# Altium project FMC_130MSPS.PrjPCB (part 2 of 2)

## Sheet ADC.SchDoc
size A3
Used 4 times, as channels U_ADC1, U_ADC2, U_ADC3, U_ADC4. Parts and nets are listed once, with the designators drawn on the sheet.
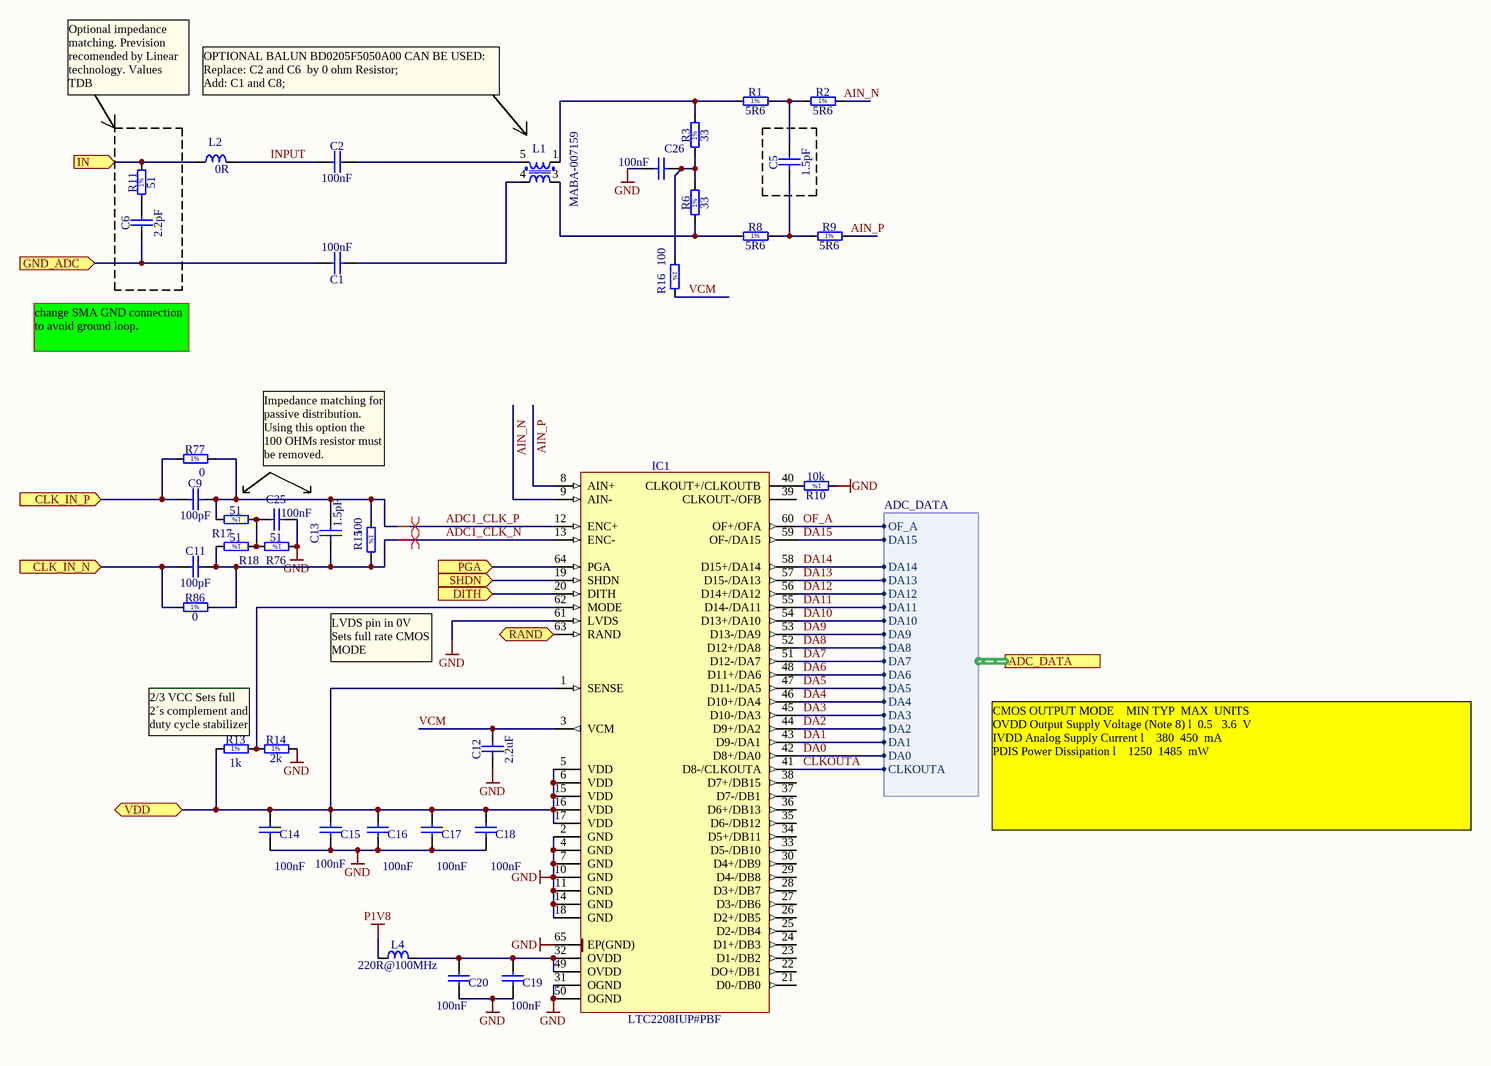
[diagram p3: ADC.SchDoc]

### Parts
C1  100nF  [CAPC0603X33N]
C2  100nF  [CAPC0603X33N]
C5  1.5pF  [CAPC1005X55N]
C6  2.2pF  [CAPC1005X55N]
C9  100pF  [CAPC1005X55N]
C11  100pF  [CAPC1005X55N]
C12  2.2uF  [CAPC1608X87N]
C13  1.5pF  [CAPC1005X55N]
C14  100nF  [CAPC0603X33N]
C15  100nF  [CAPC0603X33N]
C16  100nF  [CAPC0603X33N]
C17  100nF  [CAPC0603X33N]
C18  100nF  [CAPC0603X33N]
C19  100nF  [CAPC0603X33N]
C20  100nF  [CAPC0603X33N]
C25  100nF  [CAPC0603X33N]
C26  100nF  [CAPC0603X33N]
IC1  LTC2208IUP#PBF  [QFN50P900X900X80-65N-S725]
L1  MABA-007159  [XFMR_MA-COM_SM-22 (H260)]
L2  0R  [INDC1005X55N]
L4  220R@100MHz  [INDC2012X105N]
R1  5R6  [RESC1005X40N]
R2  5R6  [RESC1005X40N]
R3  33  [RESC1005X40N]
R6  33  [RESC1005X40N]
R8  5R6  [RESC1005X40N]
R9  5R6  [RESC1005X40N]
R10  10k  [RESC1005X40N]
R11  51  [RESC1005X40N]
R13  1k  [RESC1005X40N]
R14  2k  [RESC1005X40N]
R15  100  [RESC1005X40N]
R16  100  [RESC1005X40N]
R17  51  [RESC1005X40N]
R18  51  [RESC1005X40N]
R76  51  [RESC1005X40N]
R77  0  [RESC1005X40N]
R86  0  [RESC1005X40N]

### Ports
ADC_DATA (harness ADC_DATA), CLK_IN_N (in), CLK_IN_P (in), DITH (in), GND_ADC (in), IN (in), PGA (in), RAND (in), SHDN (in), VDD

### Harnesses
ADC_DATA: CLKOUTA, DA0, DA1, DA2, DA3, DA4, DA5, DA6, DA7, DA8, DA9, DA10, DA11, DA12, DA13, DA14, DA15, OF_A

### Nets
GND: C12.1 C14.1 C15.1 C16.1 C17.1 C18.1 C19.1 C20.1 C25.1 C26.2 IC1.2(GND) IC1.4(GND) IC1.7(GND) IC1.10(GND) IC1.11(GND) IC1.14(GND) IC1.18(GND) IC1.31(OGND) IC1.50(OGND) IC1.61(LVDS) IC1.65(EP(GND)) R10.1 R14.2 R76.1
P1V8: L4.1
ADC1_CLK_N: C11.2 C13.1 IC1.13(ENC-) R15.2 R18.2 R86.2
ADC1_CLK_P: C9.2 C13.2 IC1.12(ENC+) R15.1 R17.2 R77.2
AIN_N: IC1.9(AIN-) R2.2
AIN_P: IC1.8(AIN+) R9.2
CLK_IN_N: C11.1 R86.1 ; port CLK_IN_N
CLK_IN_P: C9.1 R77.1 ; port CLK_IN_P
CLKOUTA: IC1.41(D8-/CLKOUTA) ; port ADC_DATA.CLKOUTA
DA0: IC1.42(D8+/DA0) ; port ADC_DATA.DA0
DA1: IC1.43(D9-/DA1) ; port ADC_DATA.DA1
DA2: IC1.44(D9+/DA2) ; port ADC_DATA.DA2
DA3: IC1.45(D10-/DA3) ; port ADC_DATA.DA3
DA4: IC1.46(D10+/DA4) ; port ADC_DATA.DA4
DA5: IC1.47(D11-/DA5) ; port ADC_DATA.DA5
DA6: IC1.48(D11+/DA6) ; port ADC_DATA.DA6
DA7: IC1.51(D12-/DA7) ; port ADC_DATA.DA7
DA8: IC1.52(D12+/DA8) ; port ADC_DATA.DA8
DA9: IC1.53(D13-/DA9) ; port ADC_DATA.DA9
DA10: IC1.54(D13+/DA10) ; port ADC_DATA.DA10
DA11: IC1.55(D14-/DA11) ; port ADC_DATA.DA11
DA12: IC1.56(D14+/DA12) ; port ADC_DATA.DA12
DA13: IC1.57(D15-/DA13) ; port ADC_DATA.DA13
DA14: IC1.58(D15+/DA14) ; port ADC_DATA.DA14
DA15: IC1.59(OF-/DA15) ; port ADC_DATA.DA15
DITH: IC1.20(DITH) ; port DITH
GND_ADC: C1.2 C6.1 ; port GND_ADC
IN: L2.1 R11.2 ; port IN
INPUT: C2.1 L2.2
OF_A: IC1.60(OF+/OFA) ; port ADC_DATA.OF_A
PGA: IC1.64(PGA) ; port PGA
RAND: IC1.63(RAND) ; port RAND
SHDN: IC1.19(SHDN) ; port SHDN
VCM: C12.2 IC1.3(VCM) R16.2
VDD: C14.2 C15.2 C16.2 C17.2 C18.2 IC1.1(SENSE) IC1.5(VDD) IC1.6(VDD) IC1.15(VDD) IC1.16(VDD) IC1.17(VDD) R13.1 ; port VDD
NetC1_1: C1.1 L1.4
NetC2_2: C2.2 L1.5
NetC5_1: C5.1 R8.2 R9.1
NetC5_2: C5.2 R1.2 R2.1
NetC6_2: C6.2 R11.1
NetC19_2: C19.2 C20.2 IC1.32(OVDD) IC1.49(OVDD) L4.2
NetC25_2: C25.2 R17.1 R18.1 R76.2
NetC26_1: C26.1 R3.1 R6.2 R16.1
NetIC1_40: IC1.40(CLKOUT+/CLKOUTB) R10.2
NetIC1_62: IC1.62(MODE) R13.2 R14.1
NetL1_1: L1.1 R1.1 R3.2
NetL1_3: L1.3 R6.1 R8.1

Not connected (* = marked no-connect by the designer): IC1 21(D0-/DB0) 22(DO+/DB1) 23(D1-/DB2) 24(D1+/DB3) 25(D2-/DB4) 26(D2+/DB5) 27(D3-/DB6) 28(D3+/DB7) 29(D4-/DB8) 30(D4+/DB9) 33(D5-/DB10) 34(D5+/DB11) 35(D6-/DB12) 36(D6+/DB13) 37(D7-/DB1) 38(D7+/DB15) 39(CLKOUT-/OFB)

### Channels
U_ADC1: designators end in A; ports CLK_IN_N=ADC1_CLK_N CLK_IN_P=ADC1_CLK_P DITH=DITH_ON_OFF GND_ADC=NetC1A_2 IN=NetJ6_1 PGA=PGA_1_0 RAND=RAND_ON_OFF SHDN=SHDN_ON_OFF VDD=P3V3_ADC1
U_ADC2: designators end in B; ports CLK_IN_N=ADC2_CLK_N CLK_IN_P=ADC2_CLK_P DITH=DITH_ON_OFF GND_ADC=NetC1B_2 IN=NetJ8_1 PGA=PGA_1_0 RAND=RAND_ON_OFF SHDN=SHDN_ON_OFF VDD=P3V3_ADC2
U_ADC3: designators end in C; ports CLK_IN_N=ADC3_CLK_N CLK_IN_P=ADC3_CLK_P DITH=DITH_ON_OFF GND_ADC=NetC1C_2 IN=NetJ7_1 PGA=PGA_1_0 RAND=RAND_ON_OFF SHDN=SHDN_ON_OFF VDD=P3V3_ADC3
U_ADC4: designators end in D; ports CLK_IN_N=ADC4_CLK_N CLK_IN_P=ADC4_CLK_P DITH=DITH_ON_OFF GND_ADC=NetC1D_2 IN=NetJ5_1 PGA=PGA_1_0 RAND=RAND_ON_OFF SHDN=SHDN_ON_OFF VDD=P3V3_ADC4

### Layout directives
differential pair: ADC1_CLK_N_U_ADC1, ADC1_CLK_P_U_ADC1

### Notes on the sheet
- Optional impedance matching. Prevision recomended by Linear technology. Values TDB
- OPTIONAL BALUN BD0205F5050A00 CAN BE USED:
  Replace: C2 and C6  by 0 ohm Resistor;
  Add: C1 and C8;
- change SMA GND connection to avoid ground loop.
- Impedance matching for passive distribution. Using this option the 100 OHMs resistor must be removed.
- LVDS pin in 0V Sets full rate CMOS MODE
- 2/3 VCC Sets full 2´s complement and duty cycle stabilizer
- CMOS OUTPUT MODE 	 	MIN	TYP 	MAX 	UNITS
  OVDD Output Supply Voltage (Note 8) l 	0.5 		3.6 	V
  IVDD Analog Supply Current l 			380 	450	 mA
  PDIS Power Dissipation l 			1250 	1485 	mW
- (in symbol R0402_0R_JUMPER) 1%
- (in symbol R0402_1K_1%_0.0625W_100PPM) 1%
- (in symbol R0402_2K_1%_0.0625W_100PPM) 1%
- (in symbol R0402_5R6_1%_0.0625W_200PPM) 1%
- (in symbol R0402_10K_1%_0.0625W_100PPM) 1%
- (in symbol R0402_33R_1%_0.0625W_100PPM) 1%
- (in symbol R0402_51R_1%_0.0625W_100PPM) 1%
- (in symbol R0402_100R_1%_0.0625W_100PPM) 1%

### Library data of the parts
C1 C2 C14-C20 C25 C26 = CC0201_100NF_6.3V_10%_X5R: Non-polarised capacitor; Part Description: SMD Multilayer Chip Ceramic Capacitor; Manufacturer: GENERIC; Manufacturer1 Part Number: 02016D104KAT2A; Voltage: 6.3V; TC: X5R; Tolerance: ±10%; Table: Capacitors SMD; Part Number: CC0201_100NF_6.3V_10%_X5R; Component Kind: Standard; Component Type: Standard; Pin Count: 2; Value: 100nF; Status: Not Recommended; Manufacturer Part Number: CC0201_100NF_6.3V_10%_X5R; Case: 0201; Mounted: Yes; Socket: No; SMD: Yes; Manufacturer1 Example: AVX; Manufacturer1 ComponentHeight: 0.33mm; HelpURL: \\cern.ch\dfs\Applications\Altium\Datasheets\CC0201_X5R_AVX.pdf; Author: CERN DEM JLC; CreateDate: 2007-12-03; LatestRevisionDate: 2007-12-03
C5 C13 = CC0402_1.5PF_50V_0.25PF_NP0: Non-polarised capacitor; Part Description: SMD Multilayer Chip Ceramic Capacitor; Manufacturer: GENERIC; Manufacturer1 Part Number: 223886915158; Voltage: 50V; TC: NP0; Tolerance: ±0.25pF; Table: Capacitors SMD; Part Number: CC0402_1.5PF_50V_0.25PF_NP0; Component Kind: Standard; Component Type: Standard; Pin Count: 2; Value: 1.5pF; Status: Not Recommended; Manufacturer Part Number: CC0402_1.5PF_50V_0.25PF_NP0; Case: 0402; Mounted: Yes; Socket: No; SMD: Yes; Manufacturer1 Example: PHYCOMP; Manufacturer1 ComponentHeight: 0.55mm; HelpURL: \\cern.ch\dfs\Applications\Altium\Datasheets\CC0402_NP0_PHYCOMP.pdf; Author: CERN DEM JLC; CreateDate: 3/12/2007; LatestRevisionDate: 3/12/2007
C6 = CC0402_2.2PF_50V_0.25PF_NP0: Non-polarised capacitor; Part Description: SMD Multilayer Chip Ceramic Capacitor; Manufacturer: GENERIC; Manufacturer1 Part Number: 223886915228; Voltage: 50V; TC: NP0; Tolerance: ±0.25pF; Table: Capacitors SMD; Part Number: CC0402_2.2PF_50V_0.25PF_NP0; Component Kind: Standard; Component Type: Standard; Pin Count: 2; Value: 2.2pF; Status: Not Recommended; Manufacturer Part Number: CC0402_2.2PF_50V_0.25PF_NP0; Case: 0402; Mounted: Yes; Socket: No; SMD: Yes; Manufacturer1 Example: PHYCOMP; Manufacturer1 ComponentHeight: 0.55mm; HelpURL: \\cern.ch\dfs\Applications\Altium\Datasheets\CC0402_NP0_PHYCOMP.pdf; Author: CERN DEM JLC; CreateDate: 2007-12-03; LatestRevisionDate: 2007-12-03
C9 C11 = CC0402_100PF_50V_5%_NP0: Non-polarised capacitor; Part Description: SMD Multilayer Chip Ceramic Capacitor; Manufacturer: GENERIC; Manufacturer1 Part Number: 223886915101; Voltage: 50V; TC: NP0; Tolerance: ±5%; Table: Capacitors SMD; Part Number: CC0402_100PF_50V_5%_NP0; Component Kind: Standard; Component Type: Standard; Pin Count: 2; Value: 100pF; Status: Not Recommended; Manufacturer Part Number: CC0402_100PF_50V_5%_NP0; Case: 0402; Mounted: Yes; Socket: No; SMD: Yes; Manufacturer1 Example: PHYCOMP; Manufacturer1 ComponentHeight: 0.55mm; HelpURL: \\cern.ch\dfs\Applications\Altium\Datasheets\CC0402_NP0_PHYCOMP.pdf; Author: CERN DEM JLC; CreateDate: 3/12/2007; LatestRevisionDate: 3/12/2007
C12 = CC0603_2.2UF_16V_10%_X5R: Non-polarised capacitor; Part Description: SMD Multilayer Chip Ceramic Capacitor; Manufacturer: GENERIC; Manufacturer1 Part Number: CC0603KRX5R7BB225; Voltage: 16V; TC: X5R; Tolerance: ±10%; Table: Capacitors SMD; Part Number: CC0603_2.2UF_16V_10%_X5R; Component Kind: Standard; Component Type: Standard; Pin Count: 2; Value: 2.2uF; Status: Preferred; Manufacturer Part Number: CC0603_2.2UF_16V_10%_X5R; Case: 0603; Mounted: Yes; Socket: No; SMD: Yes; Manufacturer1 Example: YAGEO; Manufacturer1 ComponentHeight: 0.9mm; HelpURL: \\cern.ch\dfs\Applications\Altium\Datasheets\CC0805_X5R_PHYCOMP_HC.pdf; Author: CERN DEM JLC; CreateDate: 28/4/2011; LatestRevisionDate: 28/4/2011
IC1 = LTC2LTC2208IUP#PBF: 16-Bit, 130Msps ADC; Manufacturer: LINEAR TECHNOLOGY; Table: Analog & Interface; Part Number: LTC2LTC2208IUP#PBF; Component Kind: Standard; Component Type: Standard; Device: LTC2208IUP#PBF; PackageDescription: QFN, 0.50mm Pitch, Square; 64 Pin, 9.00mm L X 9.00mm W X 0.80mm H body (7.25mm X 7.25mm Thermal Tab), IPC Medium Density; Part Description: 16-Bit, 130Msps ADC; Manufacturer Part Number: LTC2208IUP#PBF; Pin Count: 65; Case: QFN64; Mounted: Yes; Socket: No; SMD: Yes; ComponentHeight: 0.8mm; Author: CERN DEM JLC; HelpURL: \\cern.ch\dfs\Applications\Altium\Datasheets\LTC2208IUP#PBF.pdf; CreateDate: 18/9/2012; LatestRevisionDate: 18/9/2012
L1 = XFMR_MA-COM_MABA-007159-000000_modified: MA-COM E-Serie RF 1:1 Transmission Line Ttransformer 4.5-3000MHz; name: MABA-007159
L2 = IND0402_MURATA_BLM15HB221SN1: Inductor; Part Description: SMD EMIFIL Suppression Chip Ferrite Bead; Manufacturer: MURATA; Value: 220R@100MHz; Power: 250mA; Resistance: 1R; Tolerance: ±25%; Table: Inductors SMD; Part Number: IND0402_MURATA_BLM15HB221SN1; Component Kind: Standard; Component Type: Standard; Pin Count: 2; Status: None; Manufacturer Part Number: BLM15HB221SN1; Case: 0402; Mounted: Yes; Socket: No; SMD: Yes; ComponentHeight: 0.55mm; HelpURL: \\cern.ch\dfs\Applications\Altium\Datasheets\IND0402_MURATA_BLM15H.pdf; Author: CERN DEM JLC; CreateDate: 23/6/2009; LatestRevisionDate: 23/6/2009
L4 = IND0805_MURATA_BLM21PG221SN1D: Inductor; Part Description: SMD EMIFIL Suppression Chip Ferrite Bead; Manufacturer: MURATA; Power: 2A; Resistance: 0.05R; Tolerance: ±25%; Table: Inductors SMD; Part Number: IND0805_MURATA_BLM21PG221SN1D; Component Kind: Standard; Component Type: Standard; Pin Count: 2; Value: 220R@100MHz; Status: None; Manufacturer Part Number: BLM21PG221SN1D; Case: 0805; Mounted: Yes; Socket: No; SMD: Yes; ComponentHeight: 1.05mm; HelpURL: \\cern.ch\dfs\Applications\Altium\Datasheets\IND0402_MURATA_BLM21P.pdf; Author: CERN DEM JLC; CreateDate: 25/1/2010; LatestRevisionDate: 25/1/2010
R1 R2 R8 R9 = R0402_5R6_1%_0.0625W_200PPM: Resistor - 1%; Part Description: General Purpose Thick Film Chip Resistor; Manufacturer: GENERIC; Manufacturer1 Part Number: 232270675608L; TC: ±200ppm/°C; Table: Resistors SMD; Part Number: R0402_5R6_1%_0.0625W_200PPM; Component Kind: Standard; Component Type: Standard; Pin Count: 2; Value: 5R6; Status: Not recommended; Power: 0.0625W; Tolerance: ±1%; Manufacturer Part Number: R0402_5R6_1%_0.0625W_200PPM; Case: 0402; Mounted: Yes; Socket: No; SMD: Yes; Manufacturer1 Example: YAGEO PHYCOMP; Manufacturer1 ComponentHeight: 0.4mm; HelpURL: \\cern.ch\dfs\Applications\Altium\Datasheets\R0402_Phycomp_RC0402.pdf; Author: CERN DEM JLC; CreateDate: 24/6/2009; LatestRevisionDate: 17/10/2012
R3 R6 = R0402_33R_1%_0.0625W_100PPM: Resistor - 1%; Part Description: General Purpose Thick Film Chip Resistor; Manufacturer: GENERIC; Manufacturer1 Part Number: 232270673309L; TC: ±100ppm/°C; Table: Resistors SMD; Part Number: R0402_33R_1%_0.0625W_100PPM; Component Kind: Standard; Component Type: Standard; Pin Count: 2; Value: 33; Status: Not recommended; Power: 0.0625W; Tolerance: ±1%; Manufacturer Part Number: R0402_33R_1%_0.0625W_100PPM; Case: 0402; Mounted: Yes; Socket: No; SMD: Yes; Manufacturer1 Example: YAGEO PHYCOMP; Manufacturer1 ComponentHeight: 0.4mm; HelpURL: \\cern.ch\dfs\Applications\Altium\Datasheets\R0402_Phycomp_RC0402.pdf; Author: CERN DEM JLC; CreateDate: 03/12/2007; LatestRevisionDate: 17/10/2012
R10 = R0402_10K_1%_0.0625W_100PPM: Resistor - 1%; Part Description: General Purpose Thick Film Chip Resistor; Manufacturer: GENERIC; Manufacturer1 Part Number: 232270671003L; TC: ±100ppm/°C; Table: Resistors SMD; Part Number: R0402_10K_1%_0.0625W_100PPM; Component Kind: Standard; Component Type: Standard; Pin Count: 2; Value: 10k; Status: Not recommended; Power: 0.0625W; Tolerance: ±1%; Manufacturer Part Number: R0402_10K_1%_0.0625W_100PPM; Case: 0402; Mounted: Yes; Socket: No; SMD: Yes; Manufacturer1 Example: YAGEO PHYCOMP; Manufacturer1 ComponentHeight: 0.4mm; HelpURL: \\cern.ch\dfs\Applications\Altium\Datasheets\R0402_Phycomp_RC0402.pdf; Author: CERN DEM JLC; CreateDate: 3/12/2007; LatestRevisionDate: 17/10/2012
R11 R17 R18 R76 = R0402_51R_1%_0.0625W_100PPM: Resistor - 1%; Part Description: General Purpose Thick Film Chip Resistor; Manufacturer: GENERIC; Manufacturer1 Part Number: 232270675109L; TC: ±100ppm/°C; Table: Resistors SMD; Part Number: R0402_51R_1%_0.0625W_100PPM; Component Kind: Standard; Component Type: Standard; Pin Count: 2; Value: 51; Status: Not recommended; Power: 0.0625W; Tolerance: ±1%; Manufacturer Part Number: R0402_51R_1%_0.0625W_100PPM; Case: 0402; Mounted: Yes; Socket: No; SMD: Yes; Manufacturer1 Example: YAGEO PHYCOMP; Manufacturer1 ComponentHeight: 0.4mm; HelpURL: \\cern.ch\dfs\Applications\Altium\Datasheets\R0402_Phycomp_RC0402.pdf; Author: CERN DEM JLC; CreateDate: 3/12/2007; LatestRevisionDate: 17/10/2012
R13 = R0402_1K_1%_0.0625W_100PPM: Resistor - 1%; Part Description: General Purpose Thick Film Chip Resistor; Manufacturer: GENERIC; Manufacturer1 Part Number: 232270671002L; TC: ±100ppm/°C; Table: Resistors SMD; Part Number: R0402_1K_1%_0.0625W_100PPM; Component Kind: Standard; Component Type: Standard; Pin Count: 2; Value: 1k; Status: Not recommended; Power: 0.0625W; Tolerance: ±1%; Manufacturer Part Number: R0402_1K_1%_0.0625W_100PPM; Case: 0402; Mounted: Yes; Socket: No; SMD: Yes; Manufacturer1 Example: YAGEO PHYCOMP; Manufacturer1 ComponentHeight: 0.4mm; HelpURL: \\cern.ch\dfs\Applications\Altium\Datasheets\R0402_Phycomp_RC0402.pdf; Author: CERN DEM JLC; CreateDate: 3/12/2007; LatestRevisionDate: 17/10/2012
R14 = R0402_2K_1%_0.0625W_100PPM: Resistor - 1%; Part Description: General Purpose Thick Film Chip Resistor; Manufacturer: GENERIC; Manufacturer1 Part Number: 232270672002L; TC: ±100ppm/°C; Table: Resistors SMD; Part Number: R0402_2K_1%_0.0625W_100PPM; Component Kind: Standard; Component Type: Standard; Pin Count: 2; Value: 2k; Status: Not recommended; Power: 0.0625W; Tolerance: ±1%; Manufacturer Part Number: R0402_2K_1%_0.0625W_100PPM; Case: 0402; Mounted: Yes; Socket: No; SMD: Yes; Manufacturer1 Example: YAGEO PHYCOMP; Manufacturer1 ComponentHeight: 0.4mm; HelpURL: \\cern.ch\dfs\Applications\Altium\Datasheets\R0402_Phycomp_RC0402.pdf; Author: CERN DEM JLC; CreateDate: 3/12/2007; LatestRevisionDate: 17/10/2012
R15 R16 = R0402_100R_1%_0.0625W_100PPM: Resistor - 1%; Part Description: General Purpose Thick Film Chip Resistor; Manufacturer: GENERIC; Manufacturer1 Part Number: 232270671001L; TC: ±100ppm/°C; Table: Resistors SMD; Part Number: R0402_100R_1%_0.0625W_100PPM; Component Kind: Standard; Component Type: Standard; Pin Count: 2; Value: 100; Status: Not recommended; Power: 0.0625W; Tolerance: ±1%; Manufacturer Part Number: R0402_100R_1%_0.0625W_100PPM; Case: 0402; Mounted: Yes; Socket: No; SMD: Yes; Manufacturer1 Example: YAGEO PHYCOMP; Manufacturer1 ComponentHeight: 0.4mm; HelpURL: \\cern.ch\dfs\Applications\Altium\Datasheets\R0402_Phycomp_RC0402.pdf; Author: CERN DEM JLC; CreateDate: 3/12/2007; LatestRevisionDate: 17/10/2012
R77 R86 = R0402_0R_JUMPER: Resistor - 1%; Part Description: 1A (0.05R Max DC Resistance) Zero Ohm Jumper; Manufacturer: GENERIC; Manufacturer1 Part Number: 232270591001; Table: Resistors SMD; Part Number: R0402_0R_JUMPER; Component Kind: Standard; Component Type: Standard; Pin Count: 2; Value: 0; Status: Not recommended; Manufacturer Part Number: R0402_0R_JUMPER; Case: 0402; Mounted: Yes; Socket: No; SMD: Yes; Manufacturer1 Example: PHYCOMP; Manufacturer1 ComponentHeight: 0.4mm; HelpURL: \\cern.ch\dfs\Applications\Altium\Datasheets\R0402_Phycomp_RC0402.pdf; Author: CERN DEM JLC; CreateDate: 2007-12-03; LatestRevisionDate: 2008-03-13

## Nets that join several sheets
GND: FMC_130MSPS_4CH (19 pins), Clock_circuit (88 pins), EEPROM_Temp_LEDs (17 pins), U_ADC1 (24 pins), U_ADC2 (24 pins), U_ADC3 (24 pins), U_ADC4 (24 pins)
P1V8: U_ADC1 (L4A.1), U_ADC2 (L4B.1), U_ADC3 (L4C.1), U_ADC4 (L4D.1)
P3V3: FMC_130MSPS_4CH (C37.2 IC14.1), EEPROM_Temp_LEDs (LD1.2)
ADC1_CLK_N: Clock_circuit (R57.2 R69.2), U_ADC1 (C11A.1 R86A.1)
ADC1_CLK_P: Clock_circuit (R56.2 R68.2), U_ADC1 (C9A.1 R77A.1)
ADC2_CLK_N: Clock_circuit (R41.2 R71.2), U_ADC2 (C11B.1 R86B.1)
ADC2_CLK_P: Clock_circuit (R33.2 R70.2), U_ADC2 (C9B.1 R77B.1)
ADC3_CLK_N: Clock_circuit (R61.2 R63.2), U_ADC3 (C11C.1 R86C.1)
ADC3_CLK_P: Clock_circuit (R60.2 R62.2), U_ADC3 (C9C.1 R77C.1)
ADC4_CLK_N: Clock_circuit (R59.2 R67.2), U_ADC4 (C11D.1 R86D.1)
ADC4_CLK_P: Clock_circuit (R58.2 R66.2), U_ADC4 (C9D.1 R77D.1)
DITH_ON_OFF: FMC_130MSPS_4CH (IC14.5), U_ADC1 (IC1A.20), U_ADC2 (IC1B.20), U_ADC3 (IC1C.20), U_ADC4 (IC1D.20)
NetC1A_2: FMC_130MSPS_4CH (J6.2), U_ADC1 (C1A.2 C6A.1)
NetC1B_2: FMC_130MSPS_4CH (J8.2), U_ADC2 (C1B.2 C6B.1)
NetC1C_2: FMC_130MSPS_4CH (J7.2), U_ADC3 (C1C.2 C6C.1)
NetC1D_2: FMC_130MSPS_4CH (J5.2), U_ADC4 (C1D.2 C6D.1)
NetJ5_1: FMC_130MSPS_4CH (J5.1), U_ADC4 (L2D.1 R11D.2)
NetJ6_1: FMC_130MSPS_4CH (J6.1), U_ADC1 (L2A.1 R11A.2)
NetJ7_1: FMC_130MSPS_4CH (J7.1), U_ADC3 (L2C.1 R11C.2)
NetJ8_1: FMC_130MSPS_4CH (J8.1), U_ADC2 (L2B.1 R11B.2)
PGA_1_0: FMC_130MSPS_4CH (IC14.7), U_ADC1 (IC1A.64), U_ADC2 (IC1B.64), U_ADC3 (IC1C.64), U_ADC4 (IC1D.64)
RAND_ON_OFF: FMC_130MSPS_4CH (IC14.6), U_ADC1 (IC1A.63), U_ADC2 (IC1B.63), U_ADC3 (IC1C.63), U_ADC4 (IC1D.63)
SHDN_ON_OFF: FMC_130MSPS_4CH (IC14.4), U_ADC1 (IC1A.19), U_ADC2 (IC1B.19), U_ADC3 (IC1C.19), U_ADC4 (IC1D.19)

## Assembly variants
passive clock: not fitted C42 C43 IC7 L5 L8 OSC1 OSC2 R11A R11B R11C R11D R51 R62 R63 R66 R67 R68 R69 R70 R71 R72 R73 R76A R76B R76C R76D R77A R77B R77C R77D R81 R82 R83 R86A R86B R86C R86D
active clock: not fitted C9A C9B C9C C9D C11A C11B C11C C11D C13A C13B C13C C13D C40 OSC1 R11A R11B R11C R11D R15A R15B R15C R15D R24 R33 R41 R51 R56 R57 R58 R59 R60 R61 R81 R82 R83